# Altium schematic sheet Digitizer.SchDoc
size A4
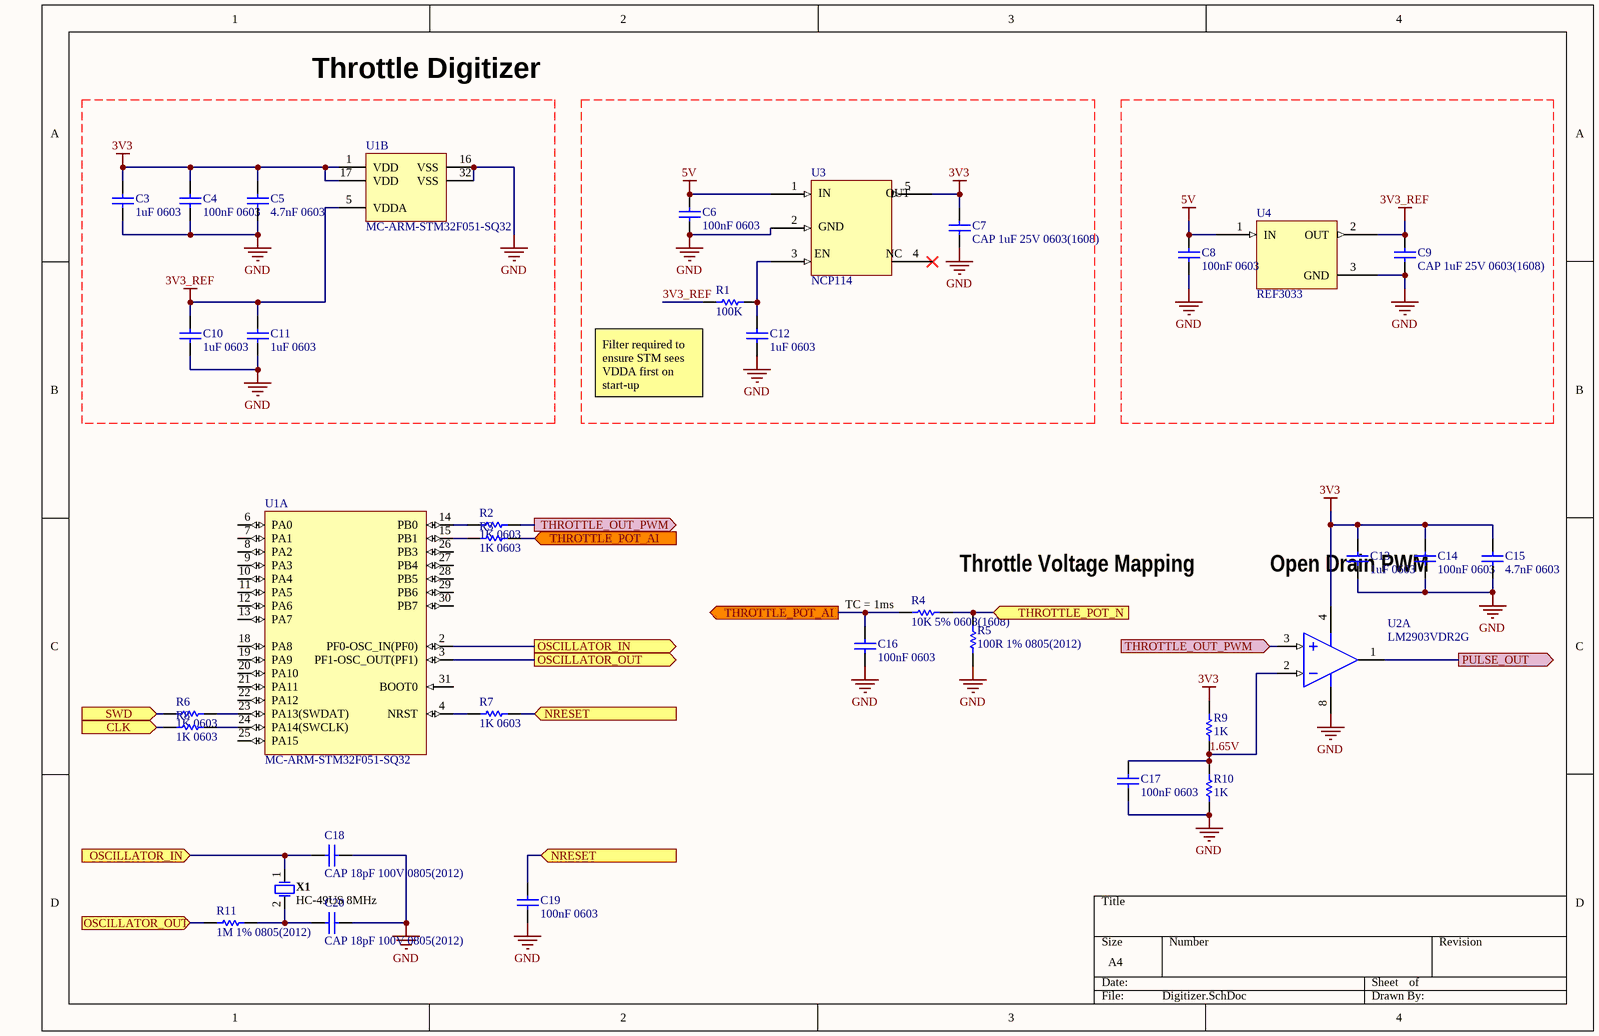
[diagram p0: Digitizer.SchDoc]

## Parts
C3  1uF 0603  [CAPC0603(1608)100_M]
C4  100nF 0603  [CAPC0603(1608)100_M]
C5  4.7nF 0603  [CAPC0603(1608)100_M]
C6  100nF 0603  [CAPC0603(1608)100_M]
C7  CAP 1uF 25V 0603(1608)  [CAPC0603(1608)100_M]
C8  100nF 0603  [CAPC0603(1608)100_M]
C9  CAP 1uF 25V 0603(1608)  [CAPC0603(1608)100_M]
C10  1uF 0603  [CAPC0603(1608)100_M]
C11  1uF 0603  [CAPC0603(1608)100_M]
C12  1uF 0603  [CAPC0603(1608)100_M]
C13  1uF 0603  [CAPC0603(1608)100_M]
C14  100nF 0603  [CAPC0603(1608)100_M]
C15  4.7nF 0603  [CAPC0603(1608)100_M]
C16  100nF 0603  [CAPC0603(1608)100_M]
C17  100nF 0603  [CAPC0603(1608)100_M]
C18  CAP 18pF 100V 0805(2012)  [CAPC0805(2012)145_M]
C19  100nF 0603  [CAPC0603(1608)100_M]
C20  CAP 18pF 100V 0805(2012)  [CAPC0805(2012)145_M]
R1  100K  [RESC0603(1608)_N]
R2  1K 0603  [RESC0603(1608)_N]
R3  1K 0603  [RESC0603(1608)_N]
R4  10K 5% 0603(1608)  [RESC0603(1608)_N]
R5  100R 1% 0805(2012)  [RESC0805(2012)_L]
R6  1K 0603  [RESC0603(1608)_N]
R7  1K 0603  [RESC0603(1608)_N]
R8  1K 0603  [RESC0603(1608)_N]
R9  1K  [RESC0603(1608)_N]
R10  1K  [RESC0603(1608)_N]
R11  1M 1% 0805(2012)  [RESC0805(2012)_N]
U1  MC-ARM-STM32F051-SQ32  [STM-LQFP32_N]  (parts A,B of 2)
U2  LM2903VDR2G  [ONSC-SOIC-8-751-07_V]  (part A of 2)
U3  NCP114  [SOT23-5_N]
U4  REF3033  [SOT23-3]
X1  HC-49US 8MHz  [JPY-HC-49US]

## Ports
CLK (in), NRESET (in), OSCILLATOR_IN (in), OSCILLATOR_IN (out), OSCILLATOR_OUT (in), OSCILLATOR_OUT (out), PULSE_OUT (out), SWD (in), THROTTLE_OUT_PWM (in), THROTTLE_OUT_PWM (out), THROTTLE_POT_AI (in), THROTTLE_POT_AI (out), THROTTLE_POT_N (in)

## Nets
3V3: C3.2 C4.2 C5.2 C7.2 C13.2 C14.2 C15.2 R9.2 U1.1(VDD) U1.17(VDD) U2.4(GND) U3.5(OUT)
3V3_REF: C9.2 C10.2 C11.2 R1.1 U1.5(VDDA) U4.2(OUT)
5V: C6.2 C8.2 U3.1(IN) U4.1(IN)
GND: C3.1 C4.1 C5.1 C6.1 C7.1 C8.1 C9.1 C10.1 C11.1 C12.1 C13.1 C14.1 C15.1 C16.1 C17.1 C18.2 C19.1 C20.2 R5.1 R10.1 U1.16(VSS) U1.32(VSS) U2.8(VCC) U3.2(GND) U4.3(GND)
1.65V: C17.2 R9.1 R10.2 U2.2(INA-)
CLK: R8.1 ; port CLK
NRESET: C19.2 R7.2 ; port NRESET
OSCILLATOR_IN: C18.1 U1.2(PF0-OSC_IN(PF0)) X1.1 ; port OSCILLATOR_IN
OSCILLATOR_OUT: R11.1 U1.3(PF1-OSC_OUT(PF1)) ; port OSCILLATOR_OUT
PULSE_OUT: U2.1(OUTA) ; port PULSE_OUT
SWD: R6.1 ; port SWD
THROTTLE_OUT_PWM: R2.2 U2.3(INA+) ; port THROTTLE_OUT_PWM
THROTTLE_POT_AI: C16.2 R3.2 R4.1 ; port THROTTLE_POT_AI
THROTTLE_POT_N: R4.2 R5.2 ; port THROTTLE_POT_N
NetC12_2: C12.2 R1.2 U3.3(EN)
NetC20_1: C20.1 R11.2 X1.2
NetR2_1: R2.1 U1.14(PB0)
NetR3_1: R3.1 U1.15(PB1)
NetR6_2: R6.2 U1.23(PA13(SWDAT))
NetR7_1: R7.1 U1.4(NRST)
NetR8_2: R8.2 U1.24(PA14(SWCLK))

Not connected (* = marked no-connect by the designer): U1 6(PA0) 7(PA1) 8(PA2) 9(PA3) 10(PA4) 11(PA5) 12(PA6) 13(PA7) 18(PA8) 19(PA9) 20(PA10) 21(PA11) 22(PA12) 25(PA15) 26(PB3) 27(PB4) 28(PB5) 29(PB6) 30(PB7) 31(BOOT0); U3 4(NC)

## Notes on the sheet
- Throttle Digitizer
- (near R1) Filter required to ensure STM sees VDDA first on start-up
- Throttle Voltage Mapping
- Open Drain PWM
- TC = 1ms

## Library data of the parts
C3-C17 C19 = CMP-1035-02742-1: CAP 1uF 25V -20% to +80% 0603 (1608 Metric) Thickness 1mm SMD; Case-Metric: 1608; Case-EIA: 0603; Technology: SMT; Tolerance: -20% to +80%; Max Thickness: 1 mm; Value: 1uF; Rated Voltage: 25 V
C18 C20 = CMP-1036-01160-1: CAP 18pF 100V ±10% 0805 (2012 Metric) Thickness 1.45mm SMD; Case-Metric: 2012; Tolerance: Â±10%; Case-EIA: 0805; Value: 18pF; Max Thickness: 1.45 mm; Technology: SMT; Rated Voltage: 100 V
R1-R3 R6-R10 = CMP-1012-00542-1: 2K 0.1W 1% 0603 (1608 Metric)  SMD; Case-EIA: 0603; Case-Metric: 1608; Power: 0.1 W; Technology: SMT; Tolerance: 1 %
  R1: Value: 100K
  R2 R3 R6-R10: Value: 1K
R4 = CMP-1012-00098-1: 10K 0.1W 5% 0603 (1608 Metric)  SMD; Case-EIA: 0603; Value: 10000.00 Ohm; Case-Metric: 1608; Technology: SMT; Tolerance: 5 %; Power: 0.1 W
R5 = CMP-1013-00397-1: 100R 0.125W 1% 0805 (2012 Metric)  SMD; Value: 100.00 Ohm; Case-Metric: 2012; Case-EIA: 0805; Technology: SMT; Power: 0.125 W; Tolerance: 1 %
R11 = CMP-1013-00849-1: 1M 0.125W 1% 0805 (2012 Metric)  SMD; Value: 1000000.00 Ohm; Case-Metric: 2012; Case-EIA: 0805; Technology: SMT; Power: 0.125 W; Tolerance: 1 %
U2 = CMP-1305-00050-1: Low Offset Voltage Dual Comparators, 2 to 36 V, -40 to 125 degC, 8-Pin SOIC, Pb-Free, Tape and Reel; Manufacturer: On Semiconductor; IO Typ (mA): 16; VCC Max (V): 36; ICC Typ (mA): 0.4; VCC Min (V): 2; PackageReference: SOIC-8-751-07; PackageVersion: Rev. AK, 02/2011; ComponentLink3Description: Package Specification; ComponentLink2URL: http://www.onsemi.com/pub_link/Collateral/LM393-D.PDF; ComponentLink2Description: Datasheet; PartNumber: LM2903VDR2G; Packing: Tape and Reel; ComponentLink1URL: http://www.onsemi.com/; RoHS: TRUE; Mounting Technology: Surface Mount; PackageDescription: 8-Pin Small Outline Integrated Circuit, Body 4.9 x 3.9 mm, Pitch 1.27 mm; ComponentLink1Description: Manufacturer URL; DatasheetVersion: Rev. 25; ComponentLink3URL: http://www.onsemi.com/pub_link/Collateral/751-07.PDF; PartId: 1
U4 = REF3033: Manufacturer PN: REF3033AIDBZR
X1 = CMP-2100-03645-1: Crystal, 16 MHz, +/- 30 ppm, 18 pF, -20 to 70 degC, 2-Pin THD; Manufacturer: Jing peng yuan; Datasheet URL: https://statics3.seeedstudio.com/images/opl/datasheet/306010014.pdf; Package Description: 2-Pin Throug Hole Device, Body 11.05 x 4.65 mm, Pitch 4.9 mm; Datasheet Version: 42125.0; Package Reference: HC-49US